# Altium schematic sheet Top.SchDoc: Top
size A4; Date: Not used; ApprovedBy: Not used; CheckedBy: Not used; Author: Not used; CompanyName: STMicroelectronics; DrawnBy: Not used; Engineer: Not used; Organization: Not used; Address1: Not used; Address2: Not used; Address3: Not used; Address4: Not used; DocumentNumber: Not used; Revision: Not used; SheetNumber: 2; SheetTotal: 12; CurrentTime: Not used; CurrentDate: Not used; Time: Not used; DocumentFullPathAndName: Not used; DocumentName: Not used; ModifiedDate: Not used; ImagePath: Not used; ProjectName: Not used; Application_BuildNumber: Not used
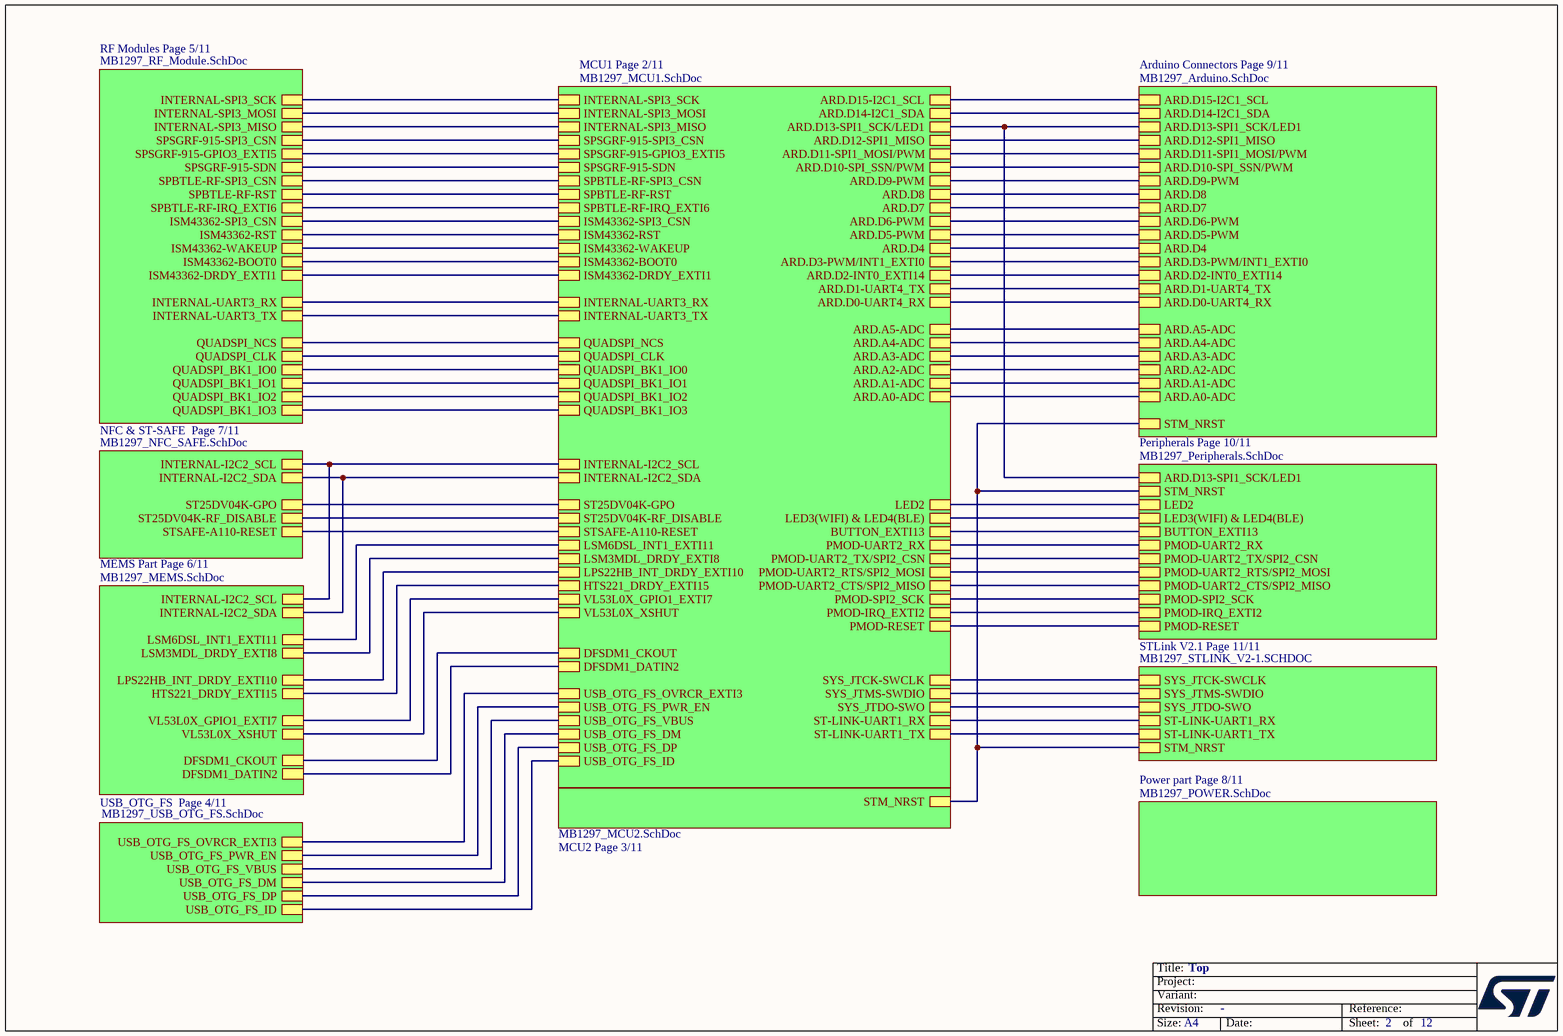
[diagram p0: Top.SchDoc]

## Sub-sheets
Arduino Connectors Page 9/11 = MB1297_Arduino.SchDoc: ARD.D3-PWM/INT1_EXTI0, ARD.D2-INT0_EXTI14, ARD.D1-UART4_TX, ARD.D0-UART4_RX, ARD.A5-ADC, ARD.A4-ADC, ARD.A3-ADC, ARD.A2-ADC, ARD.A1-ADC, ARD.A0-ADC, ARD.D4, ARD.D5-PWM, ARD.D6-PWM, ARD.D7, ARD.D8, ARD.D9-PWM, ARD.D10-SPI_SSN/PWM, ARD.D11-SPI1_MOSI/PWM, ARD.D12-SPI1_MISO, ARD.D13-SPI1_SCK/LED1, ARD.D14-I2C1_SDA, ARD.D15-I2C1_SCL, STM_NRST
MCU1 Page 2/11 = MB1297_MCU1.SchDoc: INTERNAL-SPI3_SCK, INTERNAL-SPI3_MOSI, INTERNAL-SPI3_MISO, ISM43362-SPI3_CSN, SPSGRF-915-SDN, SPSGRF-915-SPI3_CSN, SPBTLE-RF-SPI3_CSN, SYS_JTCK-SWCLK, SYS_JTMS-SWDIO, ARD.D3-PWM/INT1_EXTI0, ARD.D2-INT0_EXTI14, ARD.D1-UART4_TX, ARD.D0-UART4_RX, ARD.D4, ARD.D5-PWM, ARD.D6-PWM, ARD.D7, ARD.D8, ARD.D9-PWM, ARD.D10-SPI_SSN/PWM, ARD.D11-SPI1_MOSI/PWM, ARD.D12-SPI1_MISO, ARD.D13-SPI1_SCK/LED1, ARD.D14-I2C1_SDA, ARD.D15-I2C1_SCL, ARD.A5-ADC, ARD.A4-ADC, ARD.A3-ADC, ARD.A2-ADC, ARD.A1-ADC, ARD.A0-ADC, USB_OTG_FS_OVRCR_EXTI3, USB_OTG_FS_PWR_EN, USB_OTG_FS_VBUS, USB_OTG_FS_DM, USB_OTG_FS_DP, USB_OTG_FS_ID, INTERNAL-I2C2_SCL, INTERNAL-I2C2_SDA, ST25DV04K-GPO, ST25DV04K-RF_DISABLE, STSAFE-A110-RESET, LED2, LED3(WIFI) & LED4(BLE), BUTTON_EXTI13, PMOD-UART2_RTS/SPI2_MOSI, PMOD-UART2_CTS/SPI2_MISO, PMOD-SPI2_SCK, PMOD-IRQ_EXTI2, PMOD-RESET, PMOD-UART2_RX, PMOD-UART2_TX/SPI2_CSN, LSM6DSL_INT1_EXTI11, LSM3MDL_DRDY_EXTI8, LPS22HB_INT_DRDY_EXTI10, HTS221_DRDY_EXTI15, VL53L0X_GPIO1_EXTI7, VL53L0X_XSHUT, DFSDM1_CKOUT, DFSDM1_DATIN2, SPBTLE-RF-RST, SYS_JTDO-SWO, QUADSPI_NCS, QUADSPI_CLK, QUADSPI_BK1_IO0, QUADSPI_BK1_IO1, QUADSPI_BK1_IO2, QUADSPI_BK1_IO3, SPSGRF-915-GPIO3_EXTI5, SPBTLE-RF-IRQ_EXTI6, ISM43362-DRDY_EXTI1, ISM43362-RST, ISM43362-WAKEUP, ISM43362-BOOT0, INTERNAL-UART3_RX, INTERNAL-UART3_TX, ST-LINK-UART1_RX, ST-LINK-UART1_TX
MCU2 Page 3/11 = MB1297_MCU2.SchDoc: STM_NRST
MEMS Part Page 6/11 = MB1297_MEMS.SchDoc: INTERNAL-I2C2_SCL, INTERNAL-I2C2_SDA, LSM6DSL_INT1_EXTI11, LSM3MDL_DRDY_EXTI8, LPS22HB_INT_DRDY_EXTI10, HTS221_DRDY_EXTI15, VL53L0X_GPIO1_EXTI7, VL53L0X_XSHUT, DFSDM1_CKOUT, DFSDM1_DATIN2
NFC & ST-SAFE  Page 7/11 = MB1297_NFC_SAFE.SchDoc: INTERNAL-I2C2_SCL, INTERNAL-I2C2_SDA, ST25DV04K-GPO, ST25DV04K-RF_DISABLE, STSAFE-A110-RESET
Peripherals Page 10/11 = MB1297_Peripherals.SchDoc: STM_NRST, ARD.D13-SPI1_SCK/LED1, LED2, LED3(WIFI) & LED4(BLE), BUTTON_EXTI13, PMOD-UART2_RTS/SPI2_MOSI, PMOD-UART2_CTS/SPI2_MISO, PMOD-SPI2_SCK, PMOD-IRQ_EXTI2, PMOD-RESET, PMOD-UART2_RX, PMOD-UART2_TX/SPI2_CSN
Power part Page 8/11 = MB1297_POWER.SchDoc: no entries
RF Modules Page 5/11 = MB1297_RF_Module.SchDoc: INTERNAL-SPI3_SCK, INTERNAL-SPI3_MOSI, INTERNAL-SPI3_MISO, SPSGRF-915-SPI3_CSN, SPSGRF-915-GPIO3_EXTI5, SPSGRF-915-SDN, SPBTLE-RF-SPI3_CSN, SPBTLE-RF-RST, SPBTLE-RF-IRQ_EXTI6, QUADSPI_NCS, QUADSPI_CLK, QUADSPI_BK1_IO0, QUADSPI_BK1_IO1, QUADSPI_BK1_IO2, QUADSPI_BK1_IO3, INTERNAL-UART3_RX, INTERNAL-UART3_TX, ISM43362-SPI3_CSN, ISM43362-RST, ISM43362-WAKEUP, ISM43362-BOOT0, ISM43362-DRDY_EXTI1
STLink V2.1 Page 11/11 = MB1297_STLINK_V2-1.SCHDOC: SYS_JTCK-SWCLK, SYS_JTMS-SWDIO, SYS_JTDO-SWO, ST-LINK-UART1_RX, ST-LINK-UART1_TX, STM_NRST
USB_OTG_FS  Page 4/11 = MB1297_USB_OTG_FS.SchDoc: USB_OTG_FS_OVRCR_EXTI3, USB_OTG_FS_PWR_EN, USB_OTG_FS_VBUS, USB_OTG_FS_DM, USB_OTG_FS_DP, USB_OTG_FS_ID

## Nets
(unnamed): sheet MCU1 Page 2/11/INTERNAL-SPI3_SCK, sheet RF Modules Page 5/11/INTERNAL-SPI3_SCK
(unnamed): sheet MCU1 Page 2/11/INTERNAL-SPI3_MOSI, sheet RF Modules Page 5/11/INTERNAL-SPI3_MOSI
(unnamed): sheet MCU1 Page 2/11/INTERNAL-SPI3_MISO, sheet RF Modules Page 5/11/INTERNAL-SPI3_MISO
(unnamed): sheet MCU1 Page 2/11/ISM43362-SPI3_CSN, sheet RF Modules Page 5/11/ISM43362-SPI3_CSN
(unnamed): sheet MCU1 Page 2/11/SPSGRF-915-SDN, sheet RF Modules Page 5/11/SPSGRF-915-SDN
(unnamed): sheet MCU1 Page 2/11/SPSGRF-915-SPI3_CSN, sheet RF Modules Page 5/11/SPSGRF-915-SPI3_CSN
(unnamed): sheet MCU1 Page 2/11/SPBTLE-RF-SPI3_CSN, sheet RF Modules Page 5/11/SPBTLE-RF-SPI3_CSN
(unnamed): sheet MCU1 Page 2/11/SYS_JTCK-SWCLK, sheet STLink V2.1 Page 11/11/SYS_JTCK-SWCLK
(unnamed): sheet MCU1 Page 2/11/SYS_JTMS-SWDIO, sheet STLink V2.1 Page 11/11/SYS_JTMS-SWDIO
(unnamed): sheet MCU1 Page 2/11/ARD.D3-PWM/INT1_EXTI0, sheet Arduino Connectors Page 9/11/ARD.D3-PWM/INT1_EXTI0
(unnamed): sheet MCU1 Page 2/11/ARD.D2-INT0_EXTI14, sheet Arduino Connectors Page 9/11/ARD.D2-INT0_EXTI14
(unnamed): sheet MCU1 Page 2/11/ARD.D1-UART4_TX, sheet Arduino Connectors Page 9/11/ARD.D1-UART4_TX
(unnamed): sheet MCU1 Page 2/11/ARD.D0-UART4_RX, sheet Arduino Connectors Page 9/11/ARD.D0-UART4_RX
(unnamed): sheet MCU1 Page 2/11/ARD.D4, sheet Arduino Connectors Page 9/11/ARD.D4
(unnamed): sheet MCU1 Page 2/11/ARD.D5-PWM, sheet Arduino Connectors Page 9/11/ARD.D5-PWM
(unnamed): sheet MCU1 Page 2/11/ARD.D6-PWM, sheet Arduino Connectors Page 9/11/ARD.D6-PWM
(unnamed): sheet MCU1 Page 2/11/ARD.D7, sheet Arduino Connectors Page 9/11/ARD.D7
(unnamed): sheet MCU1 Page 2/11/ARD.D8, sheet Arduino Connectors Page 9/11/ARD.D8
(unnamed): sheet MCU1 Page 2/11/ARD.D9-PWM, sheet Arduino Connectors Page 9/11/ARD.D9-PWM
(unnamed): sheet MCU1 Page 2/11/ARD.D10-SPI_SSN/PWM, sheet Arduino Connectors Page 9/11/ARD.D10-SPI_SSN/PWM
(unnamed): sheet MCU1 Page 2/11/ARD.D11-SPI1_MOSI/PWM, sheet Arduino Connectors Page 9/11/ARD.D11-SPI1_MOSI/PWM
(unnamed): sheet MCU1 Page 2/11/ARD.D12-SPI1_MISO, sheet Arduino Connectors Page 9/11/ARD.D12-SPI1_MISO
(unnamed): sheet MCU1 Page 2/11/ARD.D13-SPI1_SCK/LED1, sheet Peripherals Page 10/11/ARD.D13-SPI1_SCK/LED1, sheet Arduino Connectors Page 9/11/ARD.D13-SPI1_SCK/LED1
(unnamed): sheet MCU1 Page 2/11/ARD.D14-I2C1_SDA, sheet Arduino Connectors Page 9/11/ARD.D14-I2C1_SDA
(unnamed): sheet MCU1 Page 2/11/ARD.D15-I2C1_SCL, sheet Arduino Connectors Page 9/11/ARD.D15-I2C1_SCL
(unnamed): sheet MCU1 Page 2/11/ARD.A5-ADC, sheet Arduino Connectors Page 9/11/ARD.A5-ADC
(unnamed): sheet MCU1 Page 2/11/ARD.A4-ADC, sheet Arduino Connectors Page 9/11/ARD.A4-ADC
(unnamed): sheet MCU1 Page 2/11/ARD.A3-ADC, sheet Arduino Connectors Page 9/11/ARD.A3-ADC
(unnamed): sheet MCU1 Page 2/11/ARD.A2-ADC, sheet Arduino Connectors Page 9/11/ARD.A2-ADC
(unnamed): sheet MCU1 Page 2/11/ARD.A1-ADC, sheet Arduino Connectors Page 9/11/ARD.A1-ADC
(unnamed): sheet MCU1 Page 2/11/ARD.A0-ADC, sheet Arduino Connectors Page 9/11/ARD.A0-ADC
(unnamed): sheet MCU1 Page 2/11/USB_OTG_FS_OVRCR_EXTI3, sheet USB_OTG_FS  Page 4/11/USB_OTG_FS_OVRCR_EXTI3
(unnamed): sheet MCU1 Page 2/11/USB_OTG_FS_PWR_EN, sheet USB_OTG_FS  Page 4/11/USB_OTG_FS_PWR_EN
(unnamed): sheet MCU1 Page 2/11/USB_OTG_FS_VBUS, sheet USB_OTG_FS  Page 4/11/USB_OTG_FS_VBUS
(unnamed): sheet MCU1 Page 2/11/USB_OTG_FS_DM, sheet USB_OTG_FS  Page 4/11/USB_OTG_FS_DM
(unnamed): sheet MCU1 Page 2/11/USB_OTG_FS_DP, sheet USB_OTG_FS  Page 4/11/USB_OTG_FS_DP
(unnamed): sheet MCU1 Page 2/11/USB_OTG_FS_ID, sheet USB_OTG_FS  Page 4/11/USB_OTG_FS_ID
(unnamed): sheet MCU1 Page 2/11/INTERNAL-I2C2_SCL, sheet NFC & ST-SAFE  Page 7/11/INTERNAL-I2C2_SCL, sheet MEMS Part Page 6/11/INTERNAL-I2C2_SCL
(unnamed): sheet MCU1 Page 2/11/INTERNAL-I2C2_SDA, sheet NFC & ST-SAFE  Page 7/11/INTERNAL-I2C2_SDA, sheet MEMS Part Page 6/11/INTERNAL-I2C2_SDA
(unnamed): sheet MCU1 Page 2/11/ST25DV04K-GPO, sheet NFC & ST-SAFE  Page 7/11/ST25DV04K-GPO
(unnamed): sheet MCU1 Page 2/11/ST25DV04K-RF_DISABLE, sheet NFC & ST-SAFE  Page 7/11/ST25DV04K-RF_DISABLE
(unnamed): sheet MCU1 Page 2/11/STSAFE-A110-RESET, sheet NFC & ST-SAFE  Page 7/11/STSAFE-A110-RESET
(unnamed): sheet MCU1 Page 2/11/LED2, sheet Peripherals Page 10/11/LED2
(unnamed): sheet MCU1 Page 2/11/LED3(WIFI) & LED4(BLE), sheet Peripherals Page 10/11/LED3(WIFI) & LED4(BLE)
(unnamed): sheet MCU1 Page 2/11/BUTTON_EXTI13, sheet Peripherals Page 10/11/BUTTON_EXTI13
(unnamed): sheet MCU1 Page 2/11/PMOD-UART2_RTS/SPI2_MOSI, sheet Peripherals Page 10/11/PMOD-UART2_RTS/SPI2_MOSI
(unnamed): sheet MCU1 Page 2/11/PMOD-UART2_CTS/SPI2_MISO, sheet Peripherals Page 10/11/PMOD-UART2_CTS/SPI2_MISO
(unnamed): sheet MCU1 Page 2/11/PMOD-SPI2_SCK, sheet Peripherals Page 10/11/PMOD-SPI2_SCK
(unnamed): sheet MCU1 Page 2/11/PMOD-IRQ_EXTI2, sheet Peripherals Page 10/11/PMOD-IRQ_EXTI2
(unnamed): sheet MCU1 Page 2/11/PMOD-RESET, sheet Peripherals Page 10/11/PMOD-RESET
(unnamed): sheet MCU1 Page 2/11/PMOD-UART2_RX, sheet Peripherals Page 10/11/PMOD-UART2_RX
(unnamed): sheet MCU1 Page 2/11/PMOD-UART2_TX/SPI2_CSN, sheet Peripherals Page 10/11/PMOD-UART2_TX/SPI2_CSN
(unnamed): sheet MCU1 Page 2/11/LSM6DSL_INT1_EXTI11, sheet MEMS Part Page 6/11/LSM6DSL_INT1_EXTI11
(unnamed): sheet MCU1 Page 2/11/LSM3MDL_DRDY_EXTI8, sheet MEMS Part Page 6/11/LSM3MDL_DRDY_EXTI8
(unnamed): sheet MCU1 Page 2/11/LPS22HB_INT_DRDY_EXTI10, sheet MEMS Part Page 6/11/LPS22HB_INT_DRDY_EXTI10
(unnamed): sheet MCU1 Page 2/11/HTS221_DRDY_EXTI15, sheet MEMS Part Page 6/11/HTS221_DRDY_EXTI15
(unnamed): sheet MCU1 Page 2/11/VL53L0X_GPIO1_EXTI7, sheet MEMS Part Page 6/11/VL53L0X_GPIO1_EXTI7
(unnamed): sheet MCU1 Page 2/11/VL53L0X_XSHUT, sheet MEMS Part Page 6/11/VL53L0X_XSHUT
(unnamed): sheet MCU1 Page 2/11/DFSDM1_CKOUT, sheet MEMS Part Page 6/11/DFSDM1_CKOUT
(unnamed): sheet MCU1 Page 2/11/DFSDM1_DATIN2, sheet MEMS Part Page 6/11/DFSDM1_DATIN2
(unnamed): sheet MCU1 Page 2/11/SPBTLE-RF-RST, sheet RF Modules Page 5/11/SPBTLE-RF-RST
(unnamed): sheet MCU1 Page 2/11/SYS_JTDO-SWO, sheet STLink V2.1 Page 11/11/SYS_JTDO-SWO
(unnamed): sheet MCU1 Page 2/11/QUADSPI_NCS, sheet RF Modules Page 5/11/QUADSPI_NCS
(unnamed): sheet MCU1 Page 2/11/QUADSPI_CLK, sheet RF Modules Page 5/11/QUADSPI_CLK
(unnamed): sheet MCU1 Page 2/11/QUADSPI_BK1_IO0, sheet RF Modules Page 5/11/QUADSPI_BK1_IO0
(unnamed): sheet MCU1 Page 2/11/QUADSPI_BK1_IO1, sheet RF Modules Page 5/11/QUADSPI_BK1_IO1
(unnamed): sheet MCU1 Page 2/11/QUADSPI_BK1_IO2, sheet RF Modules Page 5/11/QUADSPI_BK1_IO2
(unnamed): sheet MCU1 Page 2/11/QUADSPI_BK1_IO3, sheet RF Modules Page 5/11/QUADSPI_BK1_IO3
(unnamed): sheet MCU1 Page 2/11/SPSGRF-915-GPIO3_EXTI5, sheet RF Modules Page 5/11/SPSGRF-915-GPIO3_EXTI5
(unnamed): sheet MCU1 Page 2/11/SPBTLE-RF-IRQ_EXTI6, sheet RF Modules Page 5/11/SPBTLE-RF-IRQ_EXTI6
(unnamed): sheet MCU1 Page 2/11/ISM43362-DRDY_EXTI1, sheet RF Modules Page 5/11/ISM43362-DRDY_EXTI1
(unnamed): sheet MCU1 Page 2/11/ISM43362-RST, sheet RF Modules Page 5/11/ISM43362-RST
(unnamed): sheet MCU1 Page 2/11/ISM43362-WAKEUP, sheet RF Modules Page 5/11/ISM43362-WAKEUP
(unnamed): sheet MCU1 Page 2/11/ISM43362-BOOT0, sheet RF Modules Page 5/11/ISM43362-BOOT0
(unnamed): sheet MCU1 Page 2/11/INTERNAL-UART3_RX, sheet RF Modules Page 5/11/INTERNAL-UART3_RX
(unnamed): sheet MCU1 Page 2/11/INTERNAL-UART3_TX, sheet RF Modules Page 5/11/INTERNAL-UART3_TX
(unnamed): sheet MCU1 Page 2/11/ST-LINK-UART1_RX, sheet STLink V2.1 Page 11/11/ST-LINK-UART1_RX
(unnamed): sheet MCU1 Page 2/11/ST-LINK-UART1_TX, sheet STLink V2.1 Page 11/11/ST-LINK-UART1_TX
(unnamed): sheet MCU2 Page 3/11/STM_NRST, sheet Peripherals Page 10/11/STM_NRST, sheet STLink V2.1 Page 11/11/STM_NRST, sheet Arduino Connectors Page 9/11/STM_NRST

## Notes on the sheet
- Title:
- Project:
- Size:
- Revision:
- Variant:
- A4
- -
- Date:
- Reference:
- Sheet:
- of